# EAGLE design buttons (EAGLE 8.6.0)
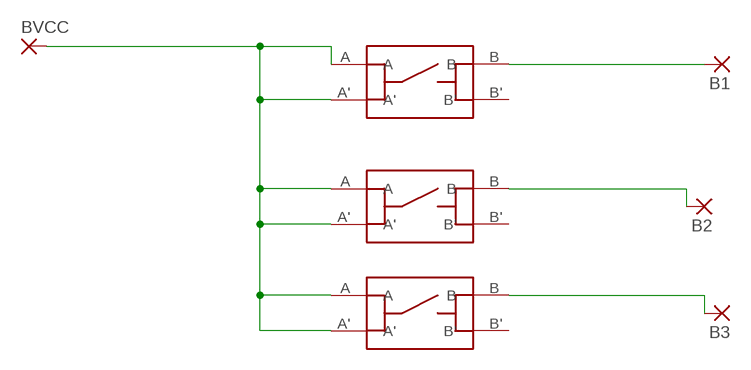
[diagram p0: schematic, sheet 1]

## Parts
B1  1,6/0,8  [1,6/0,8]
B2  1,6/0,8  [1,6/0,8]
B3  1,6/0,8  [1,6/0,8]
BVCC  1,6/0,8  [1,6/0,8]
U$1  EVPBB  [EVPVBB]
U$2  EVPBB  [EVPVBB]
U$3  EVPBB  [EVPVBB]

## Nets
N$1: BVCC.1(P) U$1.A U$1.A' U$2.A U$2.A' U$3.A U$3.A'
N$2: B1.1(P) U$1.B
N$3: B3.1(P) U$3.B
N$4: B2.1(P) U$2.B
Unconnected: U$1.B' U$2.B' U$3.B'

## Library data of the parts
B1-B3 BVCC = wirepad:1,6/0,8: THROUGH-HOLE PAD
U$1-U$3 = digikey:EVPBB

## Board
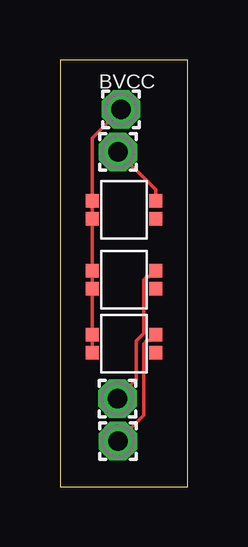
[diagram p1: board, top side]

Size 5.31 x 17.81 mm. Coordinates in mm from the lower left corner, seen from the top.
Outline: 0,0 5.31,0 5.31,17.81 0,17.81 0,0
Copper layers (1*16): Top 0.035mm / dielectric 1.5mm / Bottom 0.035mm
Design rules "default": minimum track width 6mil, minimum drill 0.35mm, track to track 6mil, track to pad 6mil, pad to pad 6mil, via to via 6mil, smd to smd 6mil, copper to edge 40mil, drill to drill 6mil, minimum pad ring 10mil, minimum via ring 8mil, stop-mask expansion 4mil, vias tented up to drill 0mil, thermal gap 10mil

### Footprints (pad centres in the part's own frame; a part is rotated, then mirrored left to right if it is on the bottom)
1,6/0,8 = drill 0.813 pad 1.6 octagon: 1 0,0
EVPVBB = smd 0.55 x 0.55: A -1.325,0.375; A' -1.325,-0.375; B 1.325,0.375; B' 1.325,-0.375

### Placement (x,y rotation side)
B1  2.39,3.68 0 top
B2  2.41,1.91 0 top
B3  2.41,13.97 0 top
BVCC  2.54,15.75 0 top
U$1  2.67,8.64 0 top
U$2  2.67,5.97 0 top
U$3  2.67,11.56 0 top

### Tracks (layer width: path | path; a pad name or v marks a point on that pad's centre or on a via)
N$1
  Top 0.152: BVCC.1 1.34,14.55 U$3.A | U$3.A 1.27,11.86 1.27,11.69 | U$3.A U$3.A' U$1.A U$1.A' U$2.A U$2.A'
N$2
  Top 0.152: U$1.B 3.75,8.77 3.62,8.77 3.49,8.63 3.49,6.39 3.18,6.09 3.18,4.48 B1.1
N$3
  Top 0.152: U$3.B 3.99,12.39 B3.1
N$4
  Top 0.152: U$2.B 3.75,6.1 3.62,6.1 3.49,5.96 3.49,2.98 B2.1